# EAGLE schematic Schematic v16 (EAGLE 9.7.0)
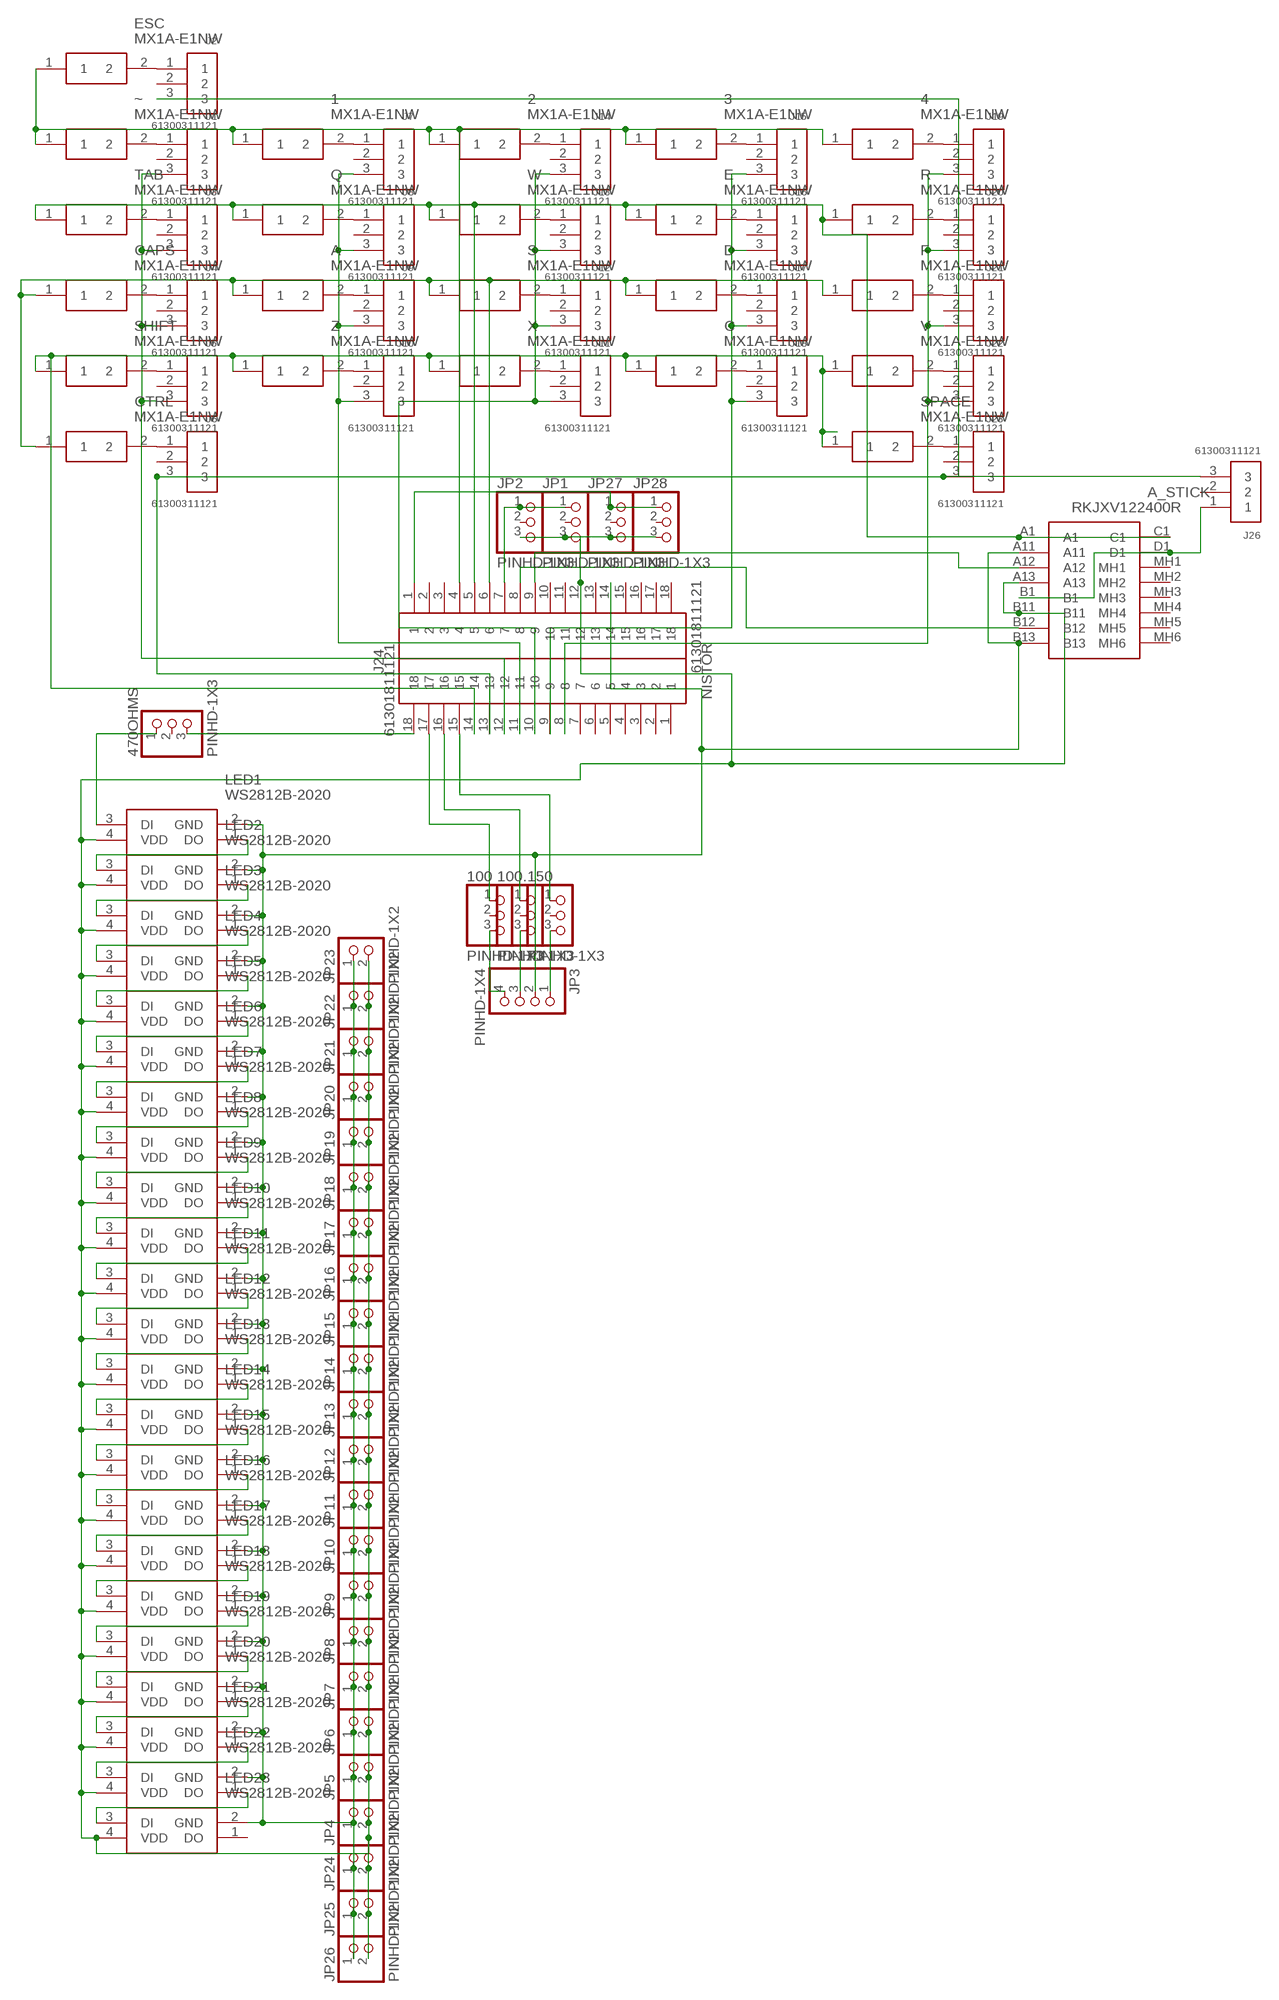
[diagram p0: schematic, sheet 1]

## Parts
1  MX1A-E1NW  [MX1AE1NW]
2  MX1A-E1NW  [MX1AE1NW]
3  MX1A-E1NW  [MX1AE1NW]
4  MX1A-E1NW  [MX1AE1NW]
100  PINHD-1X3  [1X03]
100.  PINHD-1X3  [1X03]
150  PINHD-1X3  [1X03]
470OHMS  PINHD-1X3  [1X03]
A  MX1A-E1NW  [MX1AE1NW]
A_STICK  RKJXV122400R  [RKJXV122400R]
C  MX1A-E1NW  [MX1AE1NW]
CAPS  MX1A-E1NW  [MX1AE1NW]
CTRL  MX1A-E1NW  [MX1AE1NW]
D  MX1A-E1NW  [MX1AE1NW]
E  MX1A-E1NW  [MX1AE1NW]
ESC  MX1A-E1NW  [MX1AE1NW]
F  MX1A-E1NW  [MX1AE1NW]
J1  61300311121  [61300311121]
J2  61300311121  [61300311121]
J3  61300311121  [61300311121]
J4  61300311121  [61300311121]
J5  61300311121  [61300311121]
J6  61300311121  [61300311121]
J7  61300311121  [61300311121]
J8  61300311121  [61300311121]
J9  61300311121  [61300311121]
J10  61300311121  [61300311121]
J11  61300311121  [61300311121]
J12  61300311121  [61300311121]
J13  61300311121  [61300311121]
J14  61300311121  [61300311121]
J15  61300311121  [61300311121]
J16  61300311121  [61300311121]
J17  61300311121  [61300311121]
J18  61300311121  [61300311121]
J19  61300311121  [61300311121]
J20  61300311121  [61300311121]
J21  61300311121  [61300311121]
J22  61300311121  [61300311121]
J23  61300311121  [61300311121]
J24  61301811121  [61301811121]
J26  61300311121  [61300311121]
JP1  PINHD-1X3  [1X03]
JP2  PINHD-1X3  [1X03]
JP3  PINHD-1X4  [1X04]
JP4  PINHD-1X2  [1X02]
JP5  PINHD-1X2  [1X02]
JP6  PINHD-1X2  [1X02]
JP7  PINHD-1X2  [1X02]
JP8  PINHD-1X2  [1X02]
JP9  PINHD-1X2  [1X02]
JP10  PINHD-1X2  [1X02]
JP11  PINHD-1X2  [1X02]
JP12  PINHD-1X2  [1X02]
JP13  PINHD-1X2  [1X02]
JP14  PINHD-1X2  [1X02]
JP15  PINHD-1X2  [1X02]
JP16  PINHD-1X2  [1X02]
JP17  PINHD-1X2  [1X02]
JP18  PINHD-1X2  [1X02]
JP19  PINHD-1X2  [1X02]
JP20  PINHD-1X2  [1X02]
JP21  PINHD-1X2  [1X02]
JP22  PINHD-1X2  [1X02]
JP23  PINHD-1X2  [1X02]
JP24  PINHD-1X2  [1X02]
JP25  PINHD-1X2  [1X02]
JP26  PINHD-1X2  [1X02]
JP27  PINHD-1X3  [1X03]
JP28  PINHD-1X3  [1X03]
LED1  WS2812B-2020  [WS2812B2020]
LED2  WS2812B-2020  [WS2812B2020]
LED3  WS2812B-2020  [WS2812B2020]
LED4  WS2812B-2020  [WS2812B2020]
LED5  WS2812B-2020  [WS2812B2020]
LED6  WS2812B-2020  [WS2812B2020]
LED7  WS2812B-2020  [WS2812B2020]
LED8  WS2812B-2020  [WS2812B2020]
LED9  WS2812B-2020  [WS2812B2020]
LED10  WS2812B-2020  [WS2812B2020]
LED11  WS2812B-2020  [WS2812B2020]
LED12  WS2812B-2020  [WS2812B2020]
LED13  WS2812B-2020  [WS2812B2020]
LED14  WS2812B-2020  [WS2812B2020]
LED15  WS2812B-2020  [WS2812B2020]
LED16  WS2812B-2020  [WS2812B2020]
LED17  WS2812B-2020  [WS2812B2020]
LED18  WS2812B-2020  [WS2812B2020]
LED19  WS2812B-2020  [WS2812B2020]
LED20  WS2812B-2020  [WS2812B2020]
LED21  WS2812B-2020  [WS2812B2020]
LED22  WS2812B-2020  [WS2812B2020]
LED23  WS2812B-2020  [WS2812B2020]
NISTOR  61301811121  [61301811121]
Q  MX1A-E1NW  [MX1AE1NW]
R  MX1A-E1NW  [MX1AE1NW]
S  MX1A-E1NW  [MX1AE1NW]
SHIFT  MX1A-E1NW  [MX1AE1NW]
SPACE  MX1A-E1NW  [MX1AE1NW]
TAB  MX1A-E1NW  [MX1AE1NW]
V  MX1A-E1NW  [MX1AE1NW]
W  MX1A-E1NW  [MX1AE1NW]
X  MX1A-E1NW  [MX1AE1NW]
Z  MX1A-E1NW  [MX1AE1NW]
~  MX1A-E1NW  [MX1AE1NW]

## Nets
N$1: J1.1 ~.2
N$2: ESC.2 J2.1
N$3: J3.1 TAB.2
N$4: CAPS.2 J4.1
N$5: J5.1 SHIFT.2
N$6: CTRL.2 J6.1
N$7: J11.1 X.2
N$8: J12.1 S.2
N$9: J13.1 W.2
N$10: 2.2 J14.1
N$11: 3.2 J15.1
N$12: E.2 J16.1
N$13: D.2 J17.1
N$14: C.2 J18.1
N$15: 4.2 J19.1
N$16: J20.1 R.2
N$17: F.2 J21.1
N$18: J22.1 V.2
N$19: J23.1 SPACE.2
N$20: A_STICK.A11 A_STICK.B13 J24.14 JP3.2 JP4.1 JP5.1 JP6.1 JP7.1 JP8.1 JP9.1 JP10.1 JP11.1 JP12.1 JP13.1 JP14.1 JP15.1 JP16.1 JP17.1 JP18.1 JP19.1 JP20.1 JP21.1 JP22.1 JP23.1 JP24.1 JP25.1 JP26.1 LED1.2(GND) LED2.2(GND) LED3.2(GND) LED4.2(GND) LED5.2(GND) LED6.2(GND) LED7.2(GND) LED8.2(GND) LED9.2(GND) LED10.2(GND) LED11.2(GND) LED12.2(GND) LED13.2(GND) LED14.2(GND) LED15.2(GND) LED16.2(GND) LED17.2(GND) LED18.2(GND) LED19.2(GND) LED20.2(GND) LED21.2(GND) LED22.2(GND) LED23.2(GND)
N$21: A.1 CAPS.1 CTRL.1 D.1 F.1 J24.6 S.1
N$22: A_STICK.A1 A_STICK.C1 E.1 J24.5 Q.1 R.1 TAB.1 W.1
N$23: 1.1 2.1 3.1 4.1 ESC.1 J24.4 ~.1
N$24: J1.3 J3.3 J4.3 J5.3 NISTOR.12
N$25: 1.2 J7.1
N$26: J8.1 Q.2
N$27: A.2 J9.1
N$28: J10.1 Z.2
N$29: J7.3 J8.3 J9.3 J10.3 NISTOR.11
N$30: J11.3 J12.3 J13.3 J14.3 NISTOR.10
N$31: J15.3 J16.3 J17.3 J18.3 NISTOR.9
N$32: J19.3 J20.3 J21.3 J22.3 NISTOR.8
N$33: J2.3 J6.3 J23.3 J26.3 NISTOR.13
N$34: 100.1 NISTOR.17
N$35: 100..1 NISTOR.16
N$36: 150.1 NISTOR.15
N$37: J24.1 JP27.1 JP28.1
N$38: 150.3 JP3.1
N$39: J24.7 JP1.1 JP2.1
N$41: A_STICK.A13 A_STICK.B11 J24.12 JP1.3 JP2.3 JP4.2 JP5.2 JP6.2 JP7.2 JP8.2 JP9.2 JP10.2 JP11.2 JP12.2 JP13.2 JP14.2 JP15.2 JP16.2 JP17.2 JP18.2 JP19.2 JP20.2 JP21.2 JP22.2 JP23.2 JP24.2 JP25.2 JP26.2 JP27.3 JP28.3 LED1.4(VDD) LED2.4(VDD) LED3.4(VDD) LED4.4(VDD) LED5.4(VDD) LED6.4(VDD) LED7.4(VDD) LED8.4(VDD) LED9.4(VDD) LED10.4(VDD) LED11.4(VDD) LED12.4(VDD) LED13.4(VDD) LED14.4(VDD) LED15.4(VDD) LED16.4(VDD) LED17.4(VDD) LED18.4(VDD) LED19.4(VDD) LED20.4(VDD) LED21.4(VDD) LED22.4(VDD) LED23.4(VDD)
N$42: A_STICK.B12 J24.8
N$43: A_STICK.A12 J24.9
N$44: C.1 NISTOR.14 SHIFT.1 SPACE.1 V.1 X.1 Z.1
N$45: A_STICK.B1 A_STICK.D1 J26.1
N$46: 100..3 JP3.3
N$47: LED1.1(DO) LED2.3(DI)
N$48: LED2.1(DO) LED3.3(DI)
N$49: LED3.1(DO) LED4.3(DI)
N$50: LED4.1(DO) LED5.3(DI)
N$51: LED5.1(DO) LED6.3(DI)
N$52: LED6.1(DO) LED7.3(DI)
N$53: LED7.1(DO) LED8.3(DI)
N$54: LED8.1(DO) LED9.3(DI)
N$55: LED9.1(DO) LED10.3(DI)
N$56: LED10.1(DO) LED11.3(DI)
N$57: LED11.1(DO) LED12.3(DI)
N$58: LED12.1(DO) LED13.3(DI)
N$59: LED13.1(DO) LED14.3(DI)
N$60: LED14.1(DO) LED15.3(DI)
N$61: LED15.1(DO) LED16.3(DI)
N$62: LED16.1(DO) LED17.3(DI)
N$63: LED17.1(DO) LED18.3(DI)
N$64: LED18.1(DO) LED19.3(DI)
N$65: LED19.1(DO) LED20.3(DI)
N$66: LED20.1(DO) LED21.3(DI)
N$67: LED21.1(DO) LED22.3(DI)
N$68: LED22.1(DO) LED23.3(DI)
N$69: 470OHMS.3 NISTOR.18
N$70: 100.3 JP3.4
N$71: 470OHMS.1 LED1.3(DI)
Unconnected: 100.2 100..2 150.2 470OHMS.2 A_STICK.MH1 A_STICK.MH2 A_STICK.MH3 A_STICK.MH4 A_STICK.MH5 A_STICK.MH6 J1.2 J2.2 J3.2 J4.2 J5.2 J6.2 J7.2 J8.2 J9.2 J10.2 J11.2 J12.2 J13.2 J14.2 J15.2 J16.2 J17.2 J18.2 J19.2 J20.2 J21.2 J22.2 J23.2 J24.2 J24.3 J24.10 J24.11 J24.13 J24.15 J24.16 J24.17 J24.18 J26.2 JP1.2 JP2.2 JP27.2 JP28.2 LED23.1(DO) NISTOR.1 NISTOR.2 NISTOR.3 NISTOR.4 NISTOR.5 NISTOR.6 NISTOR.7

## Library data of the parts
1-4 A C CAPS CTRL D E ESC F Q R S SHIFT SPACE TAB V W X Z ~ = SamacSys_Parts:MX1A-E1NW: Pushbutton Switches Full Travel, Mech. Keyswitch, Click Tactile Feel (Blue stem), 60cN, No LED, No Diode, Fixation Pins for PCB Mounting Source: Datasheet <https://media.digikey.com/pdf/Data Sheets/Cherry PDFs/MX Series.pdf>; DESCRIPTION: Pushbutton Switches Full Travel, Mech. Keyswitch, Click Tactile Feel (Blue stem), 60cN, No LED, No Diode, Fixation Pins for PCB Mounting; HEIGHT: 15.2mm; MANUFACTURER_NAME: Cherry; MANUFACTURER_PART_NUMBER: MX1A-E1NW; MOUSER_PART_NUMBER: 540-MX1A-E1NW; MOUSER_PRICE-STOCK: https://www.mouser.co.uk/ProductDetail/CHERRY/MX1A-E1NW/?qs=Z7NFYKyvgJd45Wm4xzFv7w%3D%3D
100 100. 150 470OHMS JP1 JP2 JP27 JP28 = Connector:PINHD-1X3: PIN HEADER; CATEGORY: CONNECTOR; SUB-CATEGORY: PIN-HEADER
A_STICK = SamacSys_Parts:RKJXV122400R: RKJXV122400R Source: Datasheet <https://tech.alpsalpine.com/prod/e/html/multicontrol/potentiometer/rkjxk/rkjxv122400r.html>; DESCRIPTION: RKJXV122400R; HEIGHT: 18.95mm; MANUFACTURER_NAME: ALPS; MANUFACTURER_PART_NUMBER: RKJXV122400R; MOUSER_PART_NUMBER: 688-RKJXV122400R; MOUSER_PRICE-STOCK: https://www.mouser.co.uk/ProductDetail/ALPS/RKJXV122400R?qs=GedFDFLaBXEbB%252ByoOVwLBg%3D%3D
J1-J23 J26 = Headers:61300311121: CONN HEADER VERT 3POS 2.54MM Manufacturer's datasheet <https://katalog.we-online.de/em/datasheet/6130xx11121.pdf>; CREATED_BY: PCBLayout.com; DIGI_KEY_PART_NUMBER: 732-5316-ND; MANUFACTURER: Wurth Electronics Inc.; MPN: 61300311121
J24 NISTOR = Headers:61301811121: CONN HEADER VERT 18POS 2.54MM Manufacturer's datasheet <https://katalog.we-online.de/em/datasheet/6130xx11121.pdf>; CREATED_BY: PCBLayout.com; DIGIKEY_PART_NUMBER: 732-5328-ND; MANUFACTURER: Wurth Electronics Inc.; MPN: 61301811121
JP3 = Connector:PINHD-1X4: PIN HEADER; CATEGORY: CONNECTOR; SUB-CATEGORY: PIN-HEADER
JP4-JP26 = Connector:PINHD-1X2: PIN HEADER; CATEGORY: CONNECTOR; SUB-CATEGORY: PIN-HEADER
LED1-LED23 = WS2812B-2020:WS2812B-2020: LED; SMD; 2020; RGB; 2x2x0.84mm; 3.75.3V; Lens: transparent; 2kHz Source: Datasheet <https://www.alldatasheet.com/datasheet-pdf/pdf/1134522/WORLDSEMI/WS2812B-2020.html>; DESCRIPTION: LED; SMD; 2020; RGB; 2x2x0.84mm; 3.75.3V; Lens: transparent; 2kHz; HEIGHT: 0.84mm; MANUFACTURER_NAME: Worldsemi; MANUFACTURER_PART_NUMBER: WS2812B-2020